# Altium schematic sheet CAN Devices.SchDoc
size A4; SheetNumber: 3; SheetTotal: 4
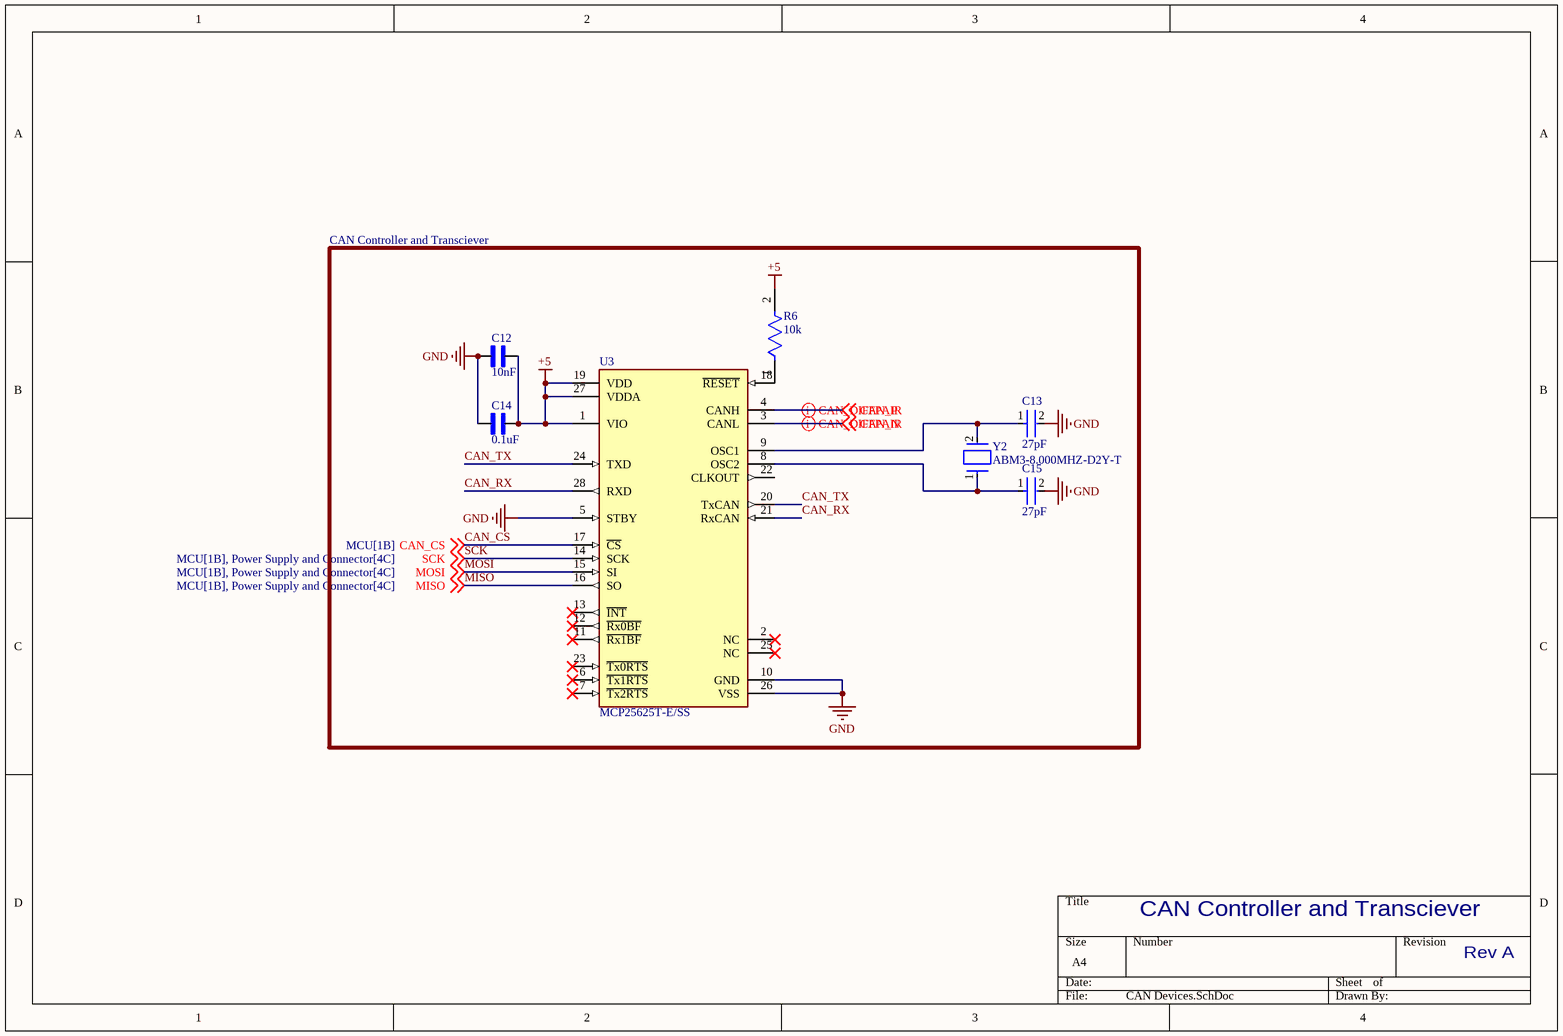
[diagram p0: CAN Devices.SchDoc]

## Parts
C12  10nF  [CAPC2012X88N]
C13  27pF  [FP-0805-L_2_01_0_2-W_1_25-MFG]
C14  0.1uF  [CAPC2012X135N]
C15  27pF  [FP-0805-L_2_01_0_2-W_1_25-MFG]
R6  10k  [FP-CRCW0805-e3-IPC_A]
U3  MCP25625T-E/SS  [FP-C04-073-IPC_B]
Y2  ABM3-8.000MHZ-D2Y-T  [FP-ABM3-MFG]

## Blocks framed on the sheet
CAN Controller and Transciever: C12-C15 R6 U3 Y2

## Nets
+5: C12.1 C14.1 R6.2 U3.1(VIO) U3.19(VDD) U3.27(VDDA)
GND: C12.2 C13.2 C14.2 C15.2 U3.5(STBY) U3.10(GND) U3.26(VSS)
CAN_CS: U3.17(~{CS}) ; off-sheet CAN_CS
CAN_N: U3.3(CANL) ; off-sheet CAN_N
CAN_P: U3.4(CANH) ; off-sheet CAN_P
CAN_RX: U3.21(RxCAN) U3.28(RXD)
CAN_TX: U3.20(TxCAN) U3.24(TXD)
MISO: U3.16(SO) ; off-sheet MISO
MOSI: U3.15(SI) ; off-sheet MOSI
SCK: U3.14(SCK) ; off-sheet SCK
NetC13_1: C13.1 U3.9(OSC1) Y2.2
NetC15_1: C15.1 U3.8(OSC2) Y2.1
NetR6_1: R6.1 U3.18(~{RESET})

Not connected (* = marked no-connect by the designer): U3 2(NC)* 6(~{Tx1RTS})* 7(~{Tx2RTS})* 11(~{Rx1BF})* 12(~{Rx0BF})* 13(~{INT})* 22(CLKOUT) 23(~{Tx0RTS})* 25(NC)*

## Layout directives
differential pair: CAN_N, CAN_P

## Notes on the sheet
- CAN Controller and Transciever
- Rev A

## Library data of the parts
C12 = C0805C103F5GACTU: CAP CER 10000PF 50V C0G/NP0 0805; MF: {'manufacturer': u'KEMET'}; Package: None; Price: None; Value: *; MP: C0805C103F5GACTU; Availability: Unavailable
C13 C15 = CMP-2007-04505-2: General Purpose Ceramic Capacitor, 0805, 27pF, 5%, C0G, 30ppm/°C, 50V; Lead Free: Lead Free; Dielectric: C0G; Case Code (Metric): 2012; RoHS Compliant: Yes; Mount: Surface Mount; Construction: Flat; Dielectric Material: Ceramic; Packaging: Tape and Reel; Voltage Rating (DC): 50V; Voltage Rating: 50V; Termination: SMD/SMT; Case/Package: 0805; Width: 0.049inch; Length: 2.01mm; Voltage: 50V; Tolerance: 5%; Case Code (Imperial): 0805; Min Operating Temperature: -55°C; Thickness: 0.037inch; Depth: 1.25mm; Height: 0.71mm; REACH SVHC: No SVHC; Capacitance: 27pF; Package Quantity: 1; Number of Pins: 2; Contact Plating: Tin; Radiation Hardening: No; Series: -; Max Operating Temperature: 125°C
C14 = GCM21BR71H104KA37L: CAP, MLCC, X7R, 0.1UF, 50V, 0805; MF: {'manufacturer': u'Murata'}; Package: None; Price: None; Value: *; MP: GCM21BR71H104KA37L; Availability: Unavailable
R6 = CMP-2001-04908-2: RES Thick Film, 10kΩ, 1%, 0.125W, 100ppm/°C, 0805; Resistance: 10kR; Voltage Rating (DC): 150V; Power Rating: 125mW; Weight: 0.000194oz; Package Quantity: 5000; Military Standard: Not; Max Operating Temperature: 155°C; Temperature Coefficient: 100ppm/°C; Contact Plating: Tin; Width: 1.25mm; Height: 0.45mm; Radiation Hardening: No; Tolerance: 1%; Min Operating Temperature: -55°C; Voltage Rating: 150V; Length: 2mm; Depth: 1.25mm; Termination: SMD/SMT; Packaging: Tape and Reel; Case/Package: 0805; Case Code (Metric): 2012; Lead Free: Lead Free; Case Code (Imperial): 0805; Composition: Thick Film
U3 = CMP-06279-000016-1: IC TRANSCEIVER 1/1 28SSOP; Max Supply Voltage: 5.5V; Number of Receivers: 1; Receiver Hysteresis: 200mV; Data Rate: 1Mbps; Min Supply Voltage: 4.5V; Propagation Delay: 125ns; Operating Supply Current: 70mA; Interface: SPI; Case/Package: SSOP; Max Operating Temperature: 125°C; Weight: 0.080001oz; Mount: Surface Mount; RoHS Compliant: Yes; Package Quantity: 2100; Packaging: Tape and Reel; Min Operating Temperature: -40°C; Number of Pins: 28; Number of Drivers: 1; Number of Transceivers: 1
Y2 = CMP-2000-05033-2: Crystal 8MHz ±20ppm 18pF SMD-2 5mm x 3.2mm; Series Resistance: 500R; Frequency Stability: 30ppm; ESR (Equivalent Series Resistance): 140R; Load Capacitance: 18pF; Height: 0.051inch; Tolerance: 20ppm; Depth: 3.2mm; Max Operating Temperature: 85°C; Frequency: 8MHz; Termination: SMD/SMT; Lead Free: Lead Free; Number of Pins: 2; Width: 3.2mm; RoHS Compliant: Yes; Resistor Type: Ceramic; Length: 5mm; Mount: Surface Mount; Case/Package: CSMD; Package Quantity: 1000; Radiation Hardening: No; Min Operating Temperature: -40°C; Packaging: Tape and Reel; Frequency Tolerance: 20ppm